# EAGLE design AtMega88 (EAGLE 6.5.0)
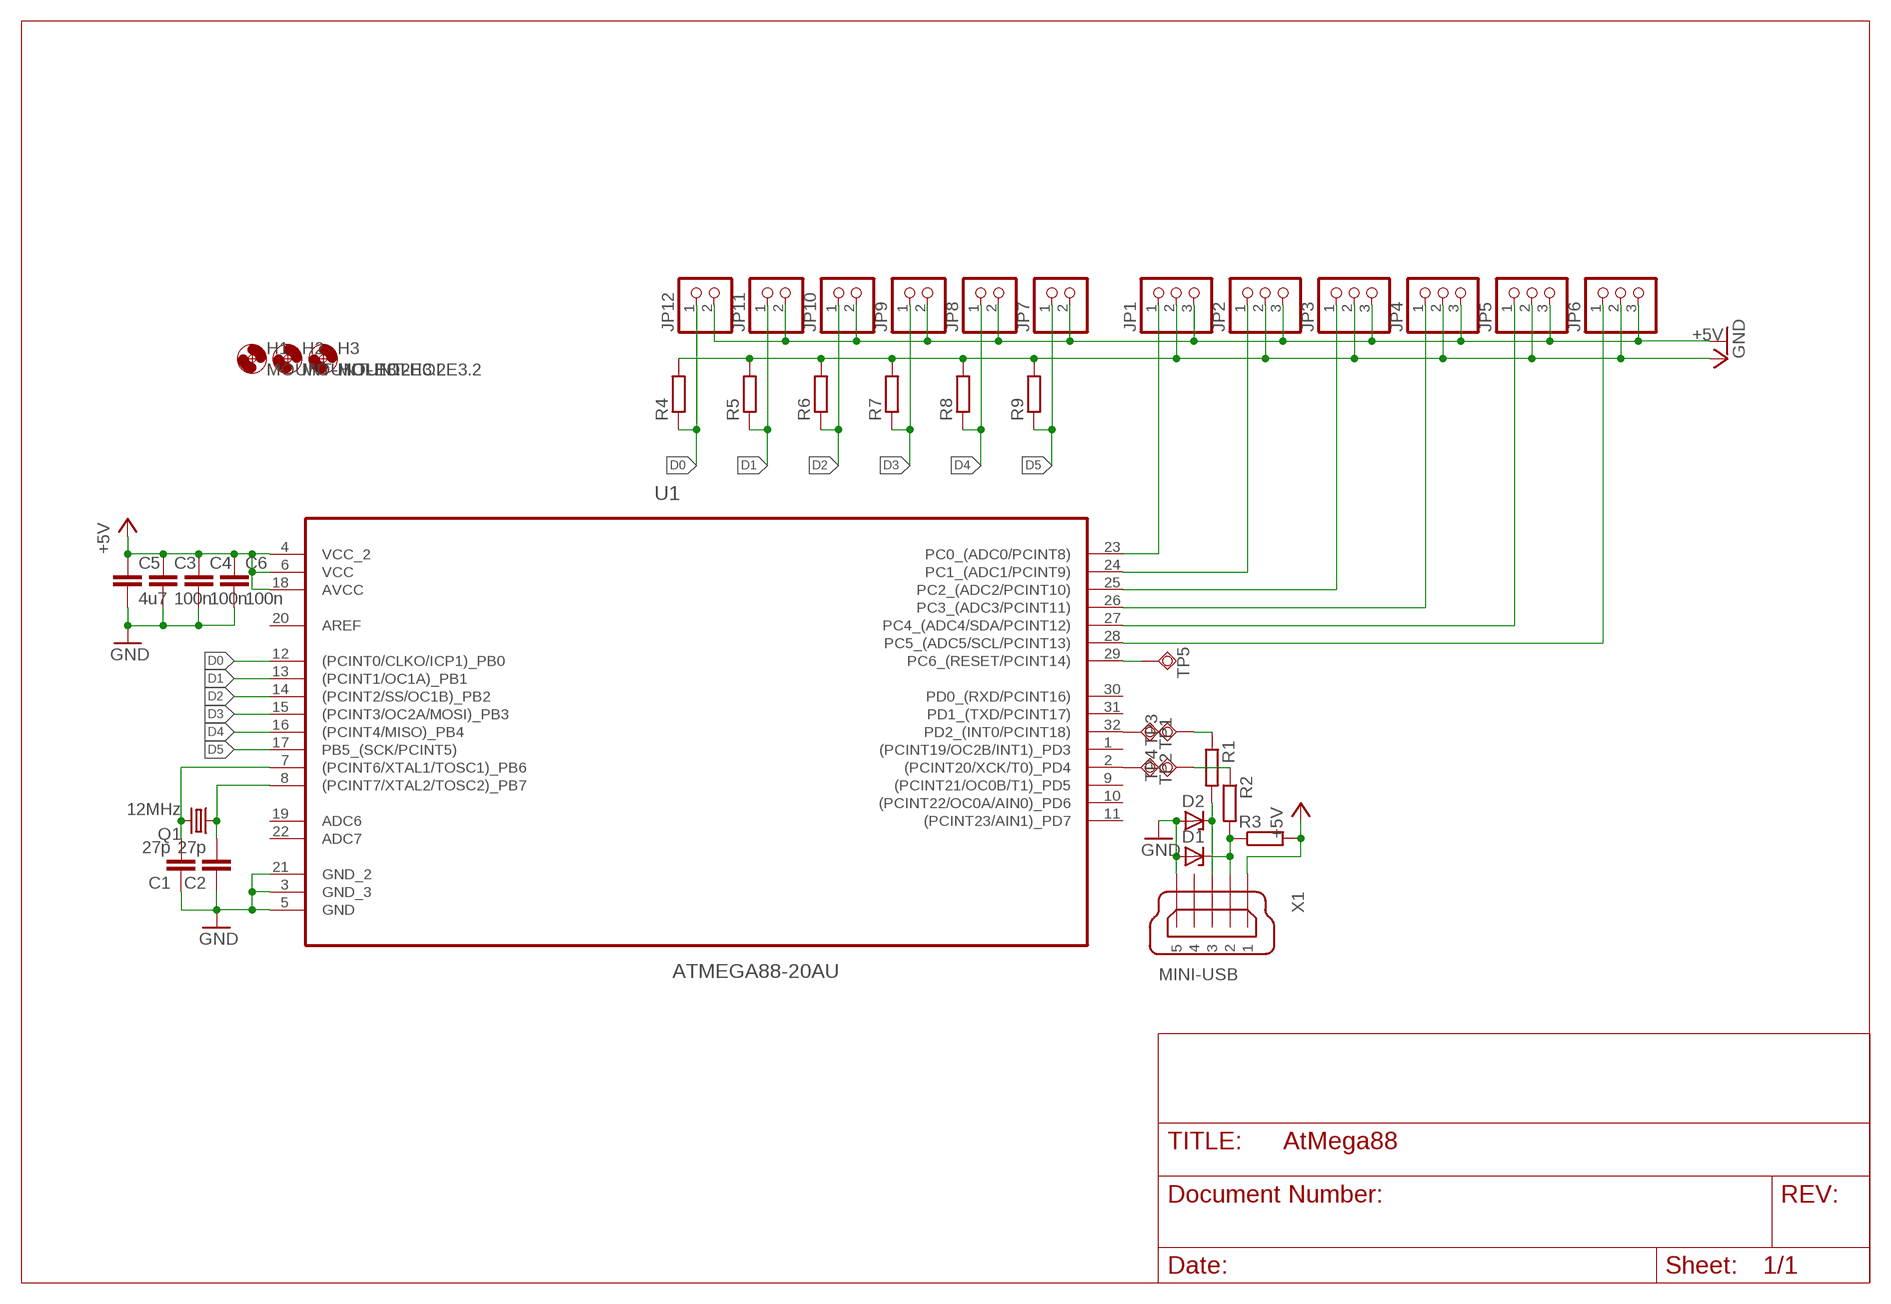
[diagram p0: schematic, sheet 1]

## Parts
C1  27p  C-EUC0805  [C0805]
C2  27p  C-EUC0805  [C0805]
C3  100n  C-EUC0805  [C0805]
C4  100n  C-EUC0805  [C0805]
C5  4u7  C-EUC0805  [C0805]
C6  100n  C-EUC0805  [C0805]
D1  ZENER-DIODESOT23  [SOT23]
D2  ZENER-DIODESOT23  [SOT23]
H1  MOUNT-HOLE3.2  [3,2]
H2  MOUNT-HOLE3.2  [3,2]
H3  MOUNT-HOLE3.2  [3,2]
JP1  PINHD-1X3  [1X03]
JP2  PINHD-1X3  [1X03]
JP3  PINHD-1X3  [1X03]
JP4  PINHD-1X3  [1X03]
JP5  PINHD-1X3  [1X03]
JP6  PINHD-1X3  [1X03]
JP7  PINHD-1X2  [1X02]
JP8  PINHD-1X2  [1X02]
JP9  PINHD-1X2  [1X02]
JP10  PINHD-1X2  [1X02]
JP11  PINHD-1X2  [1X02]
JP12  PINHD-1X2  [1X02]
Q1  12MHz  CSM-7X-DU  [CSM-7X-DU]
R1  R-EU_R1206  [R1206]
R2  R-EU_R1206  [R1206]
R3  R-EU_R1206  [R1206]
R4  R-EU_R1206  [R1206]
R5  R-EU_R1206  [R1206]
R6  R-EU_R1206  [R1206]
R7  R-EU_R1206  [R1206]
R8  R-EU_R1206  [R1206]
R9  R-EU_R1206  [R1206]
TP1  TPSQTP20SQ  [TP20SQ]
TP2  TPSQTP20SQ  [TP20SQ]
TP3  TPSQTP20SQ  [TP20SQ]
TP4  TPSQTP20SQ  [TP20SQ]
TP5  TPSQTP20SQ  [TP20SQ]
U1  ATMEGA88-20AU  [QFP80P900X900X120-32N]
X1  MINI-USB  MINI-USB-UX60A-MB-5ST  [UX60A-MB-5ST]

## Nets
+5V: C3.1 C4.1 C5.1 C6.1 JP1.2 JP2.2 JP3.2 JP4.2 JP5.2 JP6.2 R3.2 R4.2 R5.2 R6.2 R7.2 R8.2 R9.2 U1.4(VCC_2) U1.6(VCC) U1.18(AVCC) X1.1
A0: JP1.1 U1.23(PC0_(ADC0/PCINT8))
A1: JP2.1 U1.24(PC1_(ADC1/PCINT9))
A2: JP3.1 U1.25(PC2_(ADC2/PCINT10))
A3: JP4.1 U1.26(PC3_(ADC3/PCINT11))
A4: JP5.1 U1.27(PC4_(ADC4/SDA/PCINT12))
A5: JP6.1 U1.28(PC5_(ADC5/SCL/PCINT13))
D0: JP12.1 R4.1 U1.12((PCINT0/CLKO/ICP1)_PB0)
D1: JP11.1 R5.1 U1.13((PCINT1/OC1A)_PB1)
D2: JP10.1 R6.1 U1.14((PCINT2/SS/OC1B)_PB2)
D3: JP9.1 R7.1 U1.15((PCINT3/OC2A/MOSI)_PB3)
D4: JP8.1 R8.1 U1.16((PCINT4/MISO)_PB4)
D5: JP7.1 R9.1 U1.17(PB5_(SCK/PCINT5))
GND: C1.1 C2.1 C3.2 C4.2 C5.2 C6.2 D1.1(A) D2.1(A) JP1.3 JP2.3 JP3.3 JP4.3 JP5.3 JP6.3 JP7.2 JP8.2 JP9.2 JP10.2 JP11.2 JP12.2 U1.3(GND_3) U1.5(GND) U1.21(GND_2) X1.5
N$2: TP1.TP U1.32(PD2_(INT0/PCINT18))
N$3: TP2.TP U1.2((PCINT20/XCK/T0)_PD4)
N$4: C1.2 Q1.2 U1.7((PCINT6/XTAL1/TOSC1)_PB6)
N$5: C2.2 Q1.1 U1.8((PCINT7/XTAL2/TOSC2)_PB7)
N$6: R1.1 TP3.TP
N$7: R2.1 TP4.TP
N$10: D2.3(C) R1.2 X1.3
N$11: D1.3(C) R2.2 R3.1 X1.2
N$14: TP5.TP U1.29(PC6_(RESET/PCINT14))
Unconnected: U1.1((PCINT19/OC2B/INT1)_PD3) U1.9((PCINT21/OC0B/T1)_PD5) U1.10((PCINT22/OC0A/AIN0)_PD6) U1.11((PCINT23/AIN1)_PD7) U1.19(ADC6) U1.20(AREF) U1.22(ADC7) U1.30(PD0_(RXD/PCINT16)) U1.31(PD1_(TXD/PCINT17)) X1.4

## Library data of the parts
C1-C6 = rcl:C-EU: CAPACITOR, European symbol
D1 D2 = diode:ZENER-DIODE: Z-Diode
H1-H3 = holes:MOUNT-HOLE: MOUNTING HOLE with drill center marker
JP1-JP6 = pinhead:PINHD-1X3: PIN HEADER
JP7-JP12 = pinhead:PINHD-1X2: PIN HEADER
Q1 = crystal:CSM-7X-DU: SMD CRYSTAL Source: www.ecsxtal.com .. Crystal 3.6864MHz CSM_7X_DU.PDF; OC_FARNELL: unknown; OC_NEWARK: unknown
R1-R9 = rcl:R-EU_: RESISTOR, European symbol
TP1-TP5 = testpad:TPSQ: Test pad
U1 = atmel:ATMEGA88-20AU: Microcontroller; DESCRIPTION: Microcontroller; MPN: ATMEGA88-20AU; OC_FARNELL: 9171487; OC_NEWARK: 01M6912; PACKAGE: QFP-32; SUPPLIER: ATMEL
X1 = con-hirose:MINI-USB-: MINI USB Connector Source: http://www.hirose.co.jp/cataloge_hp/e24000019.pdf; OC_FARNELL: unknown; OC_NEWARK: unknown

## Board
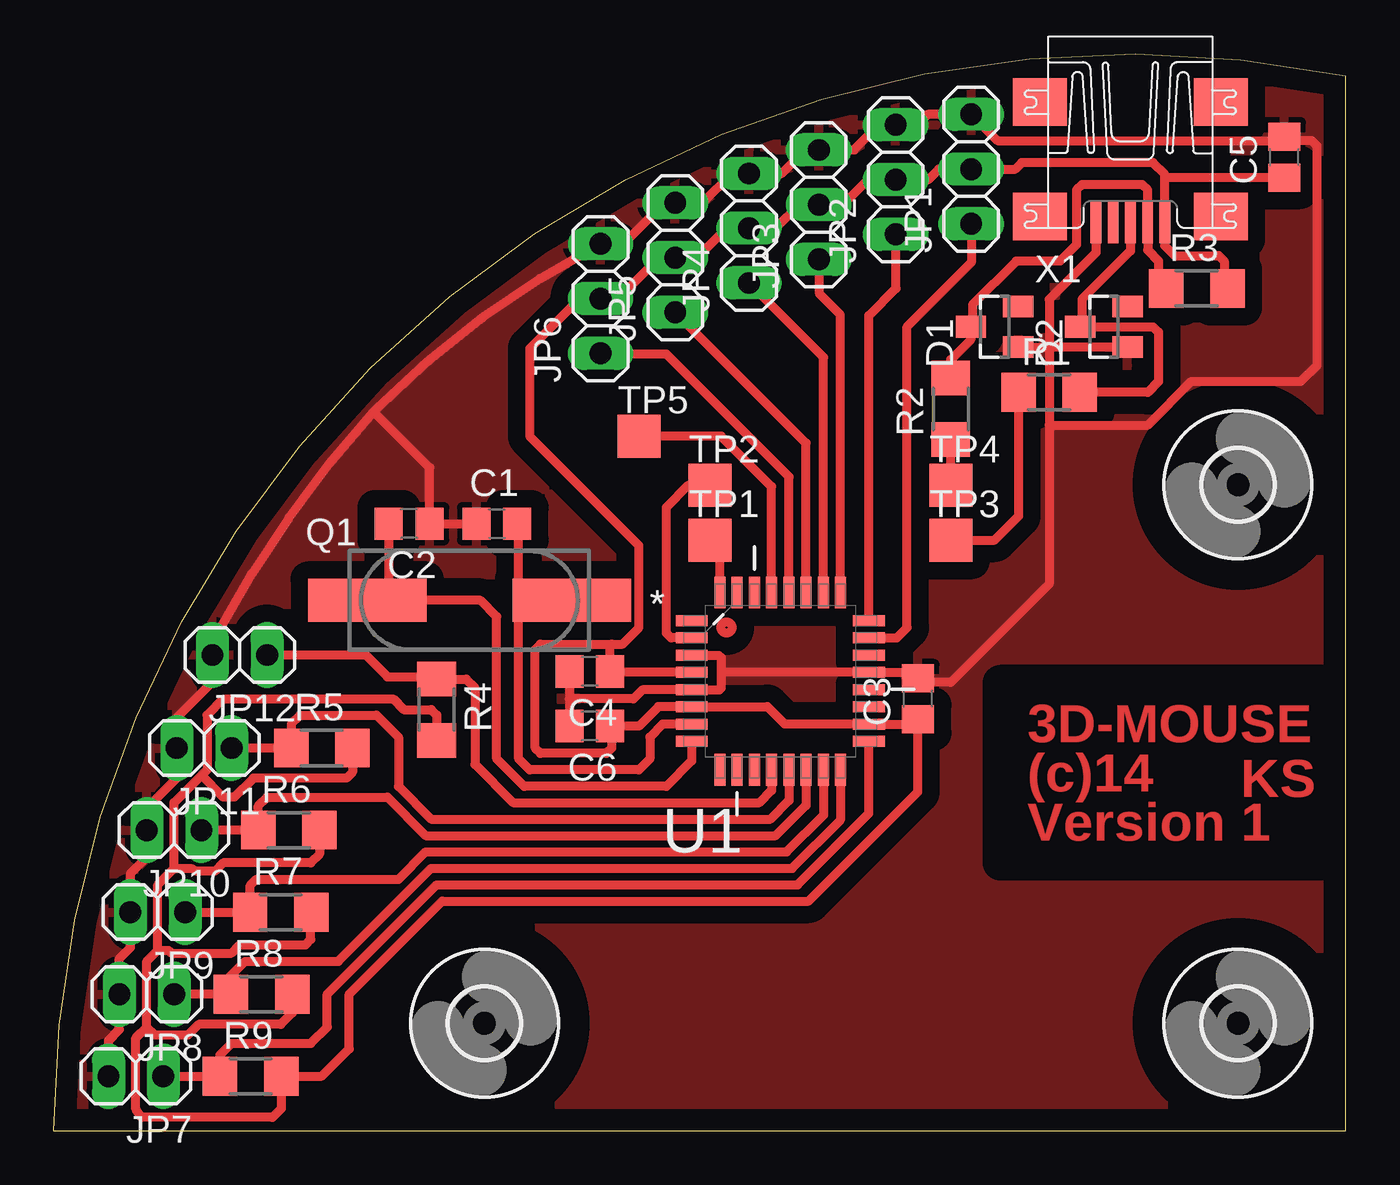
[diagram p1: board, top side]

Size 60 x 50.01 mm. Coordinates in mm from the lower left corner, seen from the top.
Outline: 0,0 60,0 60,49 arc102 0,0
Copper layers (1*16): Top 0.035mm / dielectric 1.5mm / Bottom 0.035mm
Design rules "default": minimum track width 10mil, minimum drill 24mil, track to track 8mil, track to pad 8mil, pad to pad 8mil, via to via 8mil, smd to smd 8mil, copper to edge 40mil, drill to drill 8mil, minimum pad ring 10mil, minimum via ring 8mil, stop-mask expansion 4mil, vias tented up to drill 0mil, thermal gap 10mil
tRestrict: area 43.9,12.4 to 59.2,20.8

### Footprints (pad centres in the part's own frame; a part is rotated, then mirrored left to right if it is on the bottom)
C0805 = smd 1.3 x 1.5: 1 -0.95,0; 2 0.95,0
SOT23 = smd 1 x 1.4: 1 -0.95,-1.1; 2 0.95,-1.1; 3 0,1.1
3,2 = hole 3.2: 0,0
1X03 = drill 1.016 long: 1 -2.54,0; 2 0,0; 3 2.54,0
1X02 = drill 1.016 long: 1 -1.27,0; 2 1.27,0
CSM-7X-DU = smd 5.5 x 2: 1 -4.75,0; 2 4.75,0
R1206 = smd 1.6 x 1.803: 1 -1.422,0; 2 1.422,0
TP20SQ = smd 2 x 2: TP 0,0
QFP80P900X900X120-32N = smd 1.473 x 0.508: 1 -4.115,2.794; 2 -4.115,2.007; 3 -4.115,1.194; 4 -4.115,0.406; 5 -4.115,-0.406; 6 -4.115,-1.194; 7 -4.115,-2.007; 8 -4.115,-2.794; 17 4.115,-2.794; 18 4.115,-2.007; 19 4.115,-1.194; 20 4.115,-0.406; 21 4.115,0.406; 22 4.115,1.194; 23 4.115,2.007; 24 4.115,2.794 | smd 0.508 x 1.473: 9 -2.794,-4.115; 10 -2.007,-4.115; 11 -1.194,-4.115; 12 -0.406,-4.115; 13 0.406,-4.115; 14 1.194,-4.115; 15 2.007,-4.115; 16 2.794,-4.115; 25 2.794,4.115; 26 2.007,4.115; 27 1.194,4.115; 28 0.406,4.115; 29 -0.406,4.115; 30 -1.194,4.115; 31 -2.007,4.115; 32 -2.794,4.115
UX60A-MB-5ST = smd 2 x 0.5: 1 2.25,1.6; 2 2.25,0.8; 3 2.25,0; 4 2.25,-0.8; 5 2.25,-1.6 | smd 2.2 x 2.5: M1 -3.3,-4.2; M2 -3.3,4.2; M3 2,4.2; M4 2,-4.2

### Placement (x,y rotation side)
C1  20.57,28.19 0 top
C2  16.51,28.19 180 top
C3  40.13,20.07 90 top
C4  24.89,21.34 180 top
C5  57.15,45.21 90 top
C6  24.89,18.8 180 top
D1  43.69,37.34 90 top
D2  48.77,37.34 90 top
H1  55,5 0 top
H2  55,30 0 top
H3  20,5 0 top
JP1  42.61,44.66 90 top
JP2  39.1,44.17 90 top
JP3  35.53,43.01 90 top
JP4  32.29,41.91 90 top
JP5  28.86,40.55 90 top
JP6  25.39,38.64 90 top
JP7  3.81,2.54 180 top
JP8  4.32,6.35 180 top
JP9  4.83,10.16 180 top
JP10  5.59,13.97 180 top
JP11  6.99,17.78 180 top
JP12  8.64,22.1 180 top
Q1  19.3,24.64 0 top
R1  46.23,34.29 0 top
R2  41.66,33.53 90 top
R3  53.09,39.12 0 top
R4  17.78,19.56 270 top
R5  12.45,17.78 0 top
R6  10.92,13.97 0 top
R7  10.54,10.16 0 top
R8  9.65,6.35 0 top
R9  9.14,2.54 0 top
TP1  30.48,27.43 0 top
TP2  30.48,29.97 0 top
TP3  41.66,27.43 0 top
TP4  41.66,29.97 0 top
TP5  27.18,32.26 0 top
U1  33.74,20.89 0 top
X1  50,44.46 270 top

### Tracks (layer width: path | path; a pad name or v marks a point on that pad's centre or on a via)
+5V
  Top 0.406: U1.4 25.88,21.3 C4.1 25.84,22.54 25.91,22.61 | 25.91,18.8 27.18,18.8 28.08,19.7 U1.6 33.14,19.7 33.95,18.88 U1.18 39.9,18.88 C3.1 40.13,15.75 35.05,10.67 18.03,10.67 13.72,6.35 13.72,3.81 12.45,2.54 R9.2 10.57,1.04 10.16,0.64 4.06,0.64 3.81,1.02 3.81,4.32 4.32,4.83 | 25.91,18.8 C6.1 | C5.1 51.67,44.26 51.6,44.2 | R3.2 54.36,39.27 54.36,40.39 54.1,40.64 52.07,40.64 51.6,41.11 X1.1 51.6,44.2 | 25.91,18.8 25.91,17.78 25.65,17.53 22.61,17.53 22.35,17.78 22.35,22.35 22.61,22.61 25.91,22.61 | 25.91,22.61 26.42,22.61 27.18,23.37 27.18,27.18 22.1,32.26 22.1,36.32 24.38,38.61 25.35,38.61 JP6.2 26.2,38.64 28.1,40.55 JP5.2 29.88,40.55 31.24,41.91 JP4.2 33.53,41.91 34.62,43.01 JP3.2 36.66,43.01 37.82,44.17 JP2.2 40.61,44.17 41.1,44.66 JP1.2 44.66,44.66 44.96,44.96 51.05,44.96 51.6,44.41 51.6,44.2 | 4.32,4.83 4.32,7.87 4.83,8.38 | R8.2 11.07,5.49 10.54,4.95 6.73,4.95 6.22,4.45 4.7,4.45 4.32,4.83 | 4.83,8.38 5.33,8.38 5.46,8.26 8.26,8.26 8.64,8.64 11.68,8.64 11.94,8.89 11.94,10.13 R7.2 | 13.72,17.63 R5.2 13.87,16.66 13.59,16.38 9.27,16.38 8.38,15.49 7.87,15.49 6.86,16.51 | R4.2 17.78,19.3 17.53,19.56 16.26,19.56 15.75,20.07 7.87,20.07 7.11,19.3 7.11,16.76 6.86,16.51 | 4.83,8.38 4.83,11.43 5.59,12.19 | 5.59,12.19 5.59,15.24 6.86,16.51 | R6.2 12.34,12.85 11.94,12.45 7.87,12.45 7.49,12.06 6.6,12.06 6.35,12.19 5.59,12.19
A0
  Top 0.406: U1.23 39.15,22.9 39.62,23.37 39.62,37.34 42.61,40.32 JP1.1
A1
  Top 0.406: U1.24 37.85,37.85 39.12,39.12 39.12,41.61 JP2.1
A2
  Top 0.406: U1.25 36.53,37.89 35.56,38.86 35.56,40.44 JP3.1
A3
  Top 0.406: U1.26 35.75,35.91 JP4.1
A4
  Top 0.406: U1.27 34.93,31.93 JP5.1
A5
  Top 0.406: U1.28 34.15,30.37 28.45,36.07 25.43,36.07 JP6.1
D0
  Top 0.406: JP12.1 14.48,22.1 15.49,21.08 17.68,21.08 R4.1 19.15,20.98 19.56,20.57 19.56,17.02 21.34,15.24 32.77,15.24 33.33,15.81 U1.12
D1
  Top 0.406: U1.13 34.15,15.35 33.27,14.48 17.53,14.48 16,16 16,18.29 14.99,19.3 11.43,19.3 11.02,18.9 R5.1 JP11.1
D2
  Top 0.406: JP10.1 R6.1 9.5,15.09 9.91,15.49 15.49,15.49 17.27,13.72 33.53,13.72 34.93,15.12 U1.14
D3
  Top 0.406: JP9.1 R7.1 9.12,11.4 9.4,11.68 16,11.68 17.27,12.95 34.04,12.95 35.75,14.66 U1.15
D4
  Top 0.406: R8.1 8.13,6.35 | 8.13,6.35 JP8.1 | 8.13,6.35 8.13,7.11 8.89,7.87 13.21,7.87 17.53,12.19 34.29,12.19 36.53,14.44 U1.16
D5
  Top 0.406: JP7.1 R9.1 7.72,3.53 8.26,4.06 11.94,4.06 12.7,4.83 12.7,6.35 17.78,11.43 34.54,11.43 37.85,14.73 37.85,18.09 U1.17
GND
  Top 0.406: 23.94,20.07 26.92,20.07 27.34,20.48 U1.5 30.9,20.48 30.99,20.57 30.99,21.34 | C4.2 23.94,20.07 | 23.94,20.07 C6.2 | U1.3 30.88,22.08 30.99,21.97 30.99,21.34 | X1.5 48.4,40.78 46.23,38.61 46.23,36.32 | D1.1 46.16,36.39 46.23,36.32 | D2.1 46.29,36.39 46.23,36.32 | C1.1 C2.1 17.46,30.8 14.86,33.4 | 30.99,21.34 31.03,21.3 U1.21 40.36,21.3 C3.2 40.32,20.83 41.66,20.83 46.23,25.4 46.23,32.77 | 46.23,36.32 46.23,32.77 | JP7.2 2.54,4.19 3.05,4.7 JP8.2 3.05,8 3.56,8.51 JP9.2 3.56,11.94 4.32,12.7 JP10.2 4.32,14.99 5.71,16.38 JP11.2 5.71,19.18 7.37,20.83 JP12.2 arc-28 7.62,23.11 arc-14 14.86,33.4 | 14.86,33.4 14.99,33.53 arc-17 JP6.3 26.45,41.18 28.36,43.09 JP5.3 30.13,43.09 31.5,44.45 JP4.3 33.78,44.45 34.88,45.55 JP3.3 37.16,45.55 38.33,46.71 JP2.3 40.1,46.71 40.59,47.2 JP1.3 43.83,45.97 56.96,45.97 C5.2 57.34,45.97 58.42,45.97 58.67,45.72 58.67,35.56 57.91,34.8 52.83,34.8 50.8,32.77 46.23,32.77
  pour Top (isolate 0.813): 0,0 60.07,0 59.94,49.02 59.56,49.15 arc101
N$2
  Top 0.406: U1.32 30.95,26.63 TP1.TP
N$3
  Top 0.406: U1.2 28.66,22.9 28.45,23.11 28.45,28.96 29.46,29.97 TP2.TP
N$4
  Top 0.406: U1.7 28.28,18.88 27.69,18.29 27.69,17.27 27.18,16.76 22.1,16.76 21.59,17.27 21.59,24.64 | 21.59,24.64 21.59,28.13 C1.2 | Q1.2 21.59,24.64
N$5
  Top 0.406: C2.2 15.56,24.9 Q1.1 19.81,24.64 20.57,23.88 20.57,17.27 21.84,16 28.45,16 29.62,17.18 U1.8
N$6
  Top 0.406: TP3.TP 43.69,27.43 44.81,28.55 R1.1
N$7
  Top 0.406: TP4.TP R2.1
N$10
  Top 0.406: X1.3 50,40.86 47.75,38.61 47.75,37.42 D2.3 51.05,37.34 51.31,37.08 51.31,34.8 50.8,34.29 R1.2
N$11
  Top 0.406: R3.1 51.31,39.47 51.31,40.39 50.8,40.89 X1.2 50.8,43.69 50.55,43.94 47.75,43.94 47.5,43.69 47.5,41.15 46.74,40.39 44.7,40.39 42.67,38.35 42.67,37.42 D1.3 42.59,36.75 41.66,35.81 R2.2
N$14
  Top 0.406: U1.29 33.33,29.91 30.99,32.26 27.69,32.26 27.43,32 TP5.TP
(copper drawn outside any net)
  shapes: Top circle x1

### Text on the board
Top: 3D-MOUSE | (c)14 | KS | Version 1